# Altium schematic sheet EMatches.SchDoc: SPEX - INTERFACE - EMATCHES
size A4; Author: Derek Belsky; Revision: 0; SheetNumber: 3; SheetTotal: 6
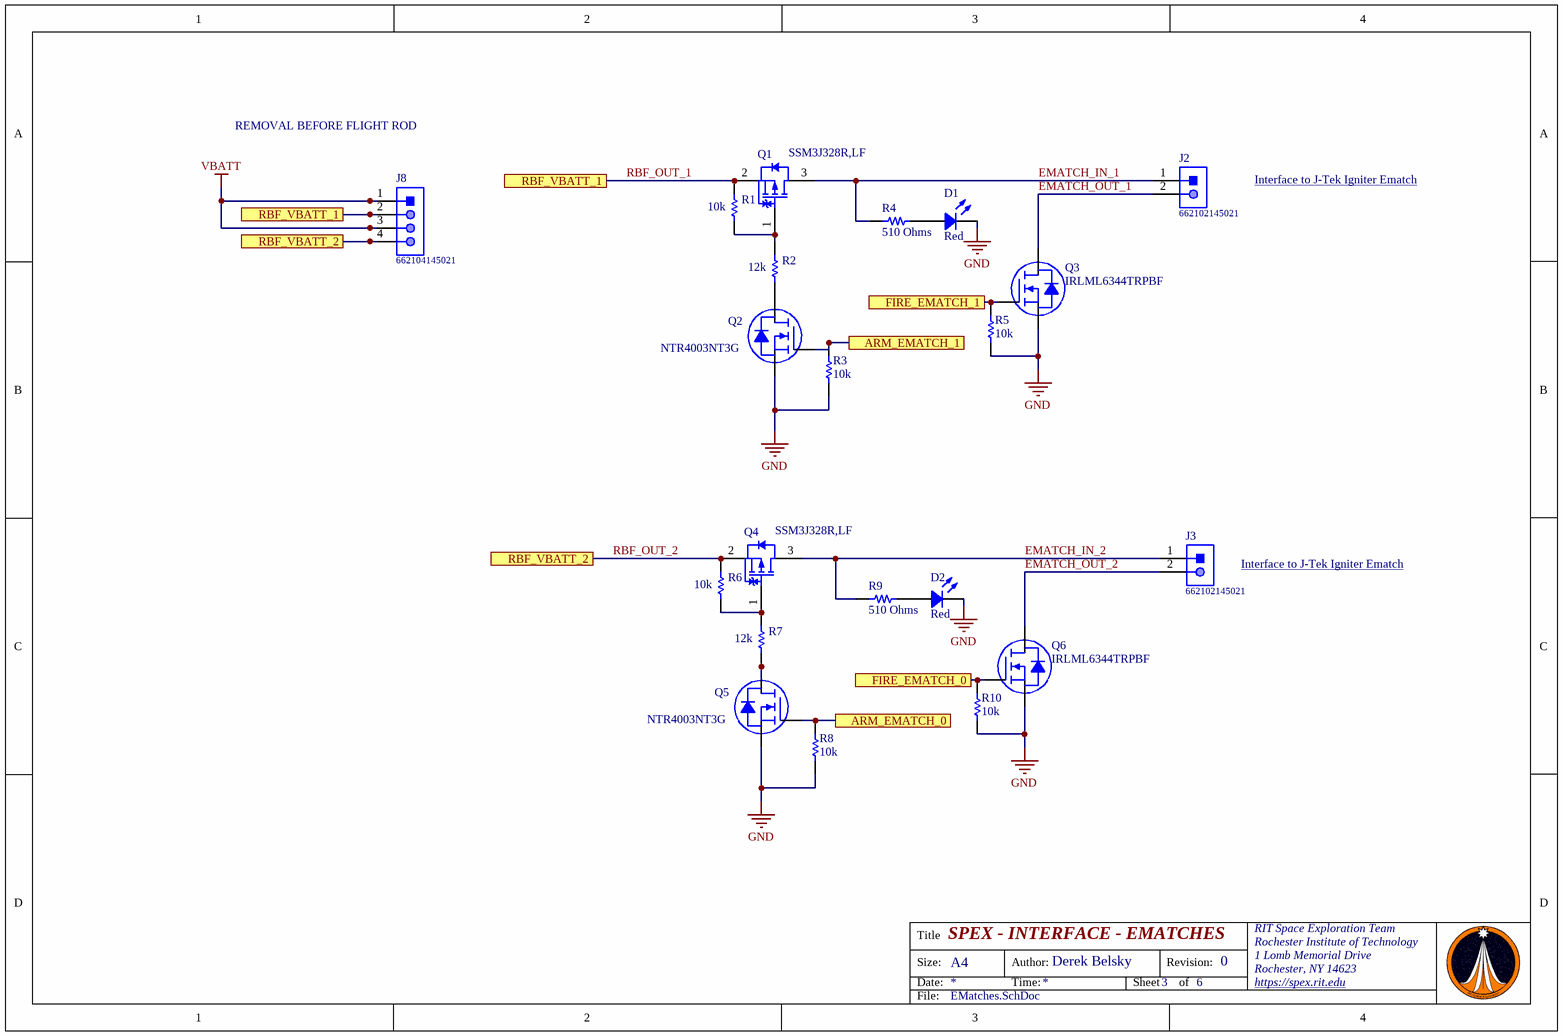
[diagram p0: EMatches.SchDoc]

## Parts
D1  Red  [LED 1206_3216 RED]
D2  Red  [LED 1206_3216 RED]
J2  662102145021  [662102145021]
J3  662102145021  [662102145021]
J8  662104145021  [662104145021]
Q1  SSM3J328R,LF  [TOSH-SOT-23F_V]
Q2  NTR4003NT3G  [ON SEMI SOT-23-3]
Q3  IRLML6344TRPBF  [INFINEON SOT-23-3]
Q4  SSM3J328R,LF  [TOSH-SOT-23F_V]
Q5  NTR4003NT3G  [ON SEMI SOT-23-3]
Q6  IRLML6344TRPBF  [INFINEON SOT-23-3]
R1  value 10k  [RESC1609X50X30NL8T20]  (hidden comment: CRCW060310K0FKEA)
R2  value 12k  [RESC1609X50X30LL10T20]  (hidden comment: CRCW060312K0FKEA)
R3  value 10k  [RESC1609X50X30NL8T20]  (hidden comment: CRCW060310K0FKEA)
R4  510 Ohms  [RES 0603_1608]
R5  value 10k  [RESC1609X50X30NL8T20]  (hidden comment: CRCW060310K0FKEA)
R6  value 10k  [RESC1609X50X30NL8T20]  (hidden comment: CRCW060310K0FKEA)
R7  value 12k  [RESC1609X50X30LL10T20]  (hidden comment: CRCW060312K0FKEA)
R8  value 10k  [RESC1609X50X30NL8T20]  (hidden comment: CRCW060310K0FKEA)
R9  510 Ohms  [RES 0603_1608]
R10  value 10k  [RESC1609X50X30NL8T20]  (hidden comment: CRCW060310K0FKEA)

## Ports
ARM_EMATCH_0, ARM_EMATCH_1, FIRE_EMATCH_0, FIRE_EMATCH_1, RBF_VBATT_1, RBF_VBATT_2

## Nets
GND: D1.2 D2.2 Q2.2(S) Q3.2(S) Q5.2(S) Q6.2(S) R3.2 R5.2 R8.2 R10.2
VBATT: J8.1 J8.3
ARM_EMATCH_0: Q5.1(G) R8.1 ; port ARM_EMATCH_0
ARM_EMATCH_1: Q2.1(G) R3.1 ; port ARM_EMATCH_1
EMATCH_IN_1: J2.1 Q1.3(D) R4.1
EMATCH_IN_2: J3.1 Q4.3(D) R9.1
EMATCH_OUT_1: J2.2 Q3.3(D)
EMATCH_OUT_2: J3.2 Q6.3(D)
FIRE_EMATCH_0: Q6.1(G) R10.1 ; port FIRE_EMATCH_0
FIRE_EMATCH_1: Q3.1(G) R5.1 ; port FIRE_EMATCH_1
RBF_OUT_1: J8.2 Q1.2(S) R1.2 ; port RBF_VBATT_1
RBF_OUT_2: J8.4 Q4.2(S) R6.2 ; port RBF_VBATT_2
NetD1_1: D1.1 R4.2
NetD2_1: D2.1 R9.2
NetQ1_1: Q1.1(G) R1.1 R2.2
NetQ2_3: Q2.3(D) R2.1
NetQ4_1: Q4.1(G) R6.1 R7.2
NetQ5_3: Q5.3(D) R7.1

## Notes on the sheet
- REMOVAL BEFORE FLIGHT ROD
- Interface to J-Tek Igniter Ematch <https://electricmatch.com/pyrotechnics/see/9/5/j-tek-igniter>
- Title
- Size:
- Date:
- A4
- Author:
- Time:
- Sheet
- Revision:
- of
- RIT Space Exploration Team
- Rochester Institute of Technology
- 1 Lomb Memorial Drive
- Rochester, NY 14623
- https://spex.rit.edu
- File:

## Library data of the parts
D1 D2 = HSMC-C350: LED RED CHIP SMD; Manufacturer: Broadcom Limited; Configuration: Standard; Current - Test: 20mA; Lens Color: 1.20mm; Lens Size: 1.10mm Dia; Lens Style: Round with Domed Top; Viewing Angle: 70°; Voltage - Forward (Vf) (Typ): 2V; Wavelength - Dominant: 630nm; Wavelength - Peak: 643nm; Part Number: HSMC-C350; Color: Red; ComponentLink1Description: Datasheet; ComponentLink1URL: https://docs.broadcom.com/docs/HSMC-C350-DS100; ComponentLink2Description: DigiKey Link; ComponentLink2URL: http://digikey.com/product-detail/en/broadcom-limited/HSMC-C350/516-4369-1-ND/10239796; Device Package: 1206 (3216 Metric); Height (Max): 1.20mm; LastUpdated: 1/21/2020 3:14:28 AM; Lifecycle Status: Active; Minimum Order: 1; Mounting Type: Surface Mount; Package / Case: 1206 (3216 Metric); Packaging: TapeAndReel; PartId: 195; Part Status: Active; Price: 0.21; Series: -; Size / Dimension: 3.20mm L x 1.60mm W; Supplier 1: DigiKey; Supplier Part Number 1: 516-4369-1-ND; Supplier Device Package: Chip LED; Value: Red
J2 J3 = CMP-1502-00482-1: SMT Male Header WR-MPC3, with SMT Solder Tabs, Right Angled, Single Row, pitch 3 mm, 2 pins; Manufacturer: Wurth Elektronik; Contact Resistance: 10mOhm; Working Voltage: 250VAC; Pitch: 3mm; Pin Number: 2; Mounting Technology: SMT; Orientation: RightAngled; Part Number: 662102145021; Datasheet URL: https://katalog.we-online.de/em/datasheet/6621xx145021.pdf; Manufacturer URL: http://www.we-online.de; Packaging: TapeandReel; Publisher: WurthElektronik; Gender: Male; Operating Temperature: -40to105degC; Package Reference: 662102145021
J8 = CMP-1502-00484-1: SMT Male Header WR-MPC3, with SMT Solder Tabs, Right Angled, Single Row, pitch 3 mm, 4 pins; Manufacturer: Wurth Elektronik; Pitch: 3mm; Pin Number: 4; Working Voltage: 250VAC; Contact Resistance: 10mOhm; Part Number: 662104145021; Packaging: TapeandReel; Manufacturer URL: http://www.we-online.de; Orientation: RightAngled; Datasheet URL: https://katalog.we-online.de/em/datasheet/6621xx145021.pdf; Operating Temperature: -40to105degC; Publisher: WurthElektronik; Mounting Technology: SMT; Gender: Male; Package Reference: 662104145021
Q1 Q4 = CMP-2100-03686-1: TOSHIBA Field-Effect Transistor Silicon P-Channel MOS Type (U-MOS VI), 20 V, -55 to 125 degC, 3-Pin SOTFL, RoHS, Tape and Reel; Gate to Source Voltage (Vgs): 8V; Drain to Source Breakdown Voltage: -20V; Turn-Off Delay Time: 107ns; Continuous Drain Current (ID): 6A; Rds On Max: 29.8mOhm; Number of Elements: 1; Turn-On Delay Time: 32ns; Drain to Source Resistance: 47.4mOhm; Drain to Source Voltage (Vdss): 20V; Power Dissipation: 2W; Element Configuration: Single; Max Power Dissipation: 1W; Input Capacitance: 840pF; Manufacturer URL: http://www.toshiba.com/; Number of Pins: 3; Number of Channels: 1; Max Operating Temperature: 150degC; Min Operating Temperature: -55degC; Manufacturer: Toshiba; Mount: SurfaceMount; Package Description: 3-Pin Small Outline Transistor, Flat Lead, Body 2.9 x 1.8 mm, Pitch 0.95 mm; Radiation Hardening: No; Package Quantity: 3000; Package Reference: SOT-23F; RoHSCompliant: true; Package URL: https://toshiba.semicon-storage.com/ap-en/design-support/package/detail.SOT-23F.html; Packaging: TapeandReel; Datasheet Version: 41699.0; Case/Package: SOT-23-3; Datasheet URL: https://toshiba.semicon-storage.com/info/docget.jsp?did=2429&prodName=SSM3J328R
Q2 Q5 = NTR4003NT3G: MOSFET N-CH 30V 500MA SOT-23; Manufacturer: ON Semiconductor; Current - Continuous Drain (Id) @ 25°C: 500mA (Ta); Drive Voltage (Max Rds On,  Min Rds On): 2.5V, 4V; FET Type: N-Channel; Gate Charge (Qg) (Max) @ Vgs: 1.15nC @ 5V; Input Capacitance (Ciss) (Max) @ Vds: 21pF @ 5V; Power Dissipation (Max): 690mW (Ta); Rds On (Max) @ Id, Vgs: 1.5Ohm @ 10mA, 4V; Vgs (Max): ±20V; Vgs(th) (Max) @ Id: 1.4V @ 250µA; Part Number: NTR4003NT3G; ComponentLink1Description: Datasheet; ComponentLink1URL: http://www.onsemi.com/pub/Collateral/NTR4003N-D.PDF; ComponentLink2Description: DigiKey Link; ComponentLink2URL: http://digikey.com/product-detail/en/on-semiconductor/NTR4003NT3G/NTR4003NT3GOSCT-ND/1967271; Device Package: TO-236-3, SC-59, SOT-23-3; Drain to Source Voltage (Vdss): 30V; LastUpdated: 1/21/2020 4:01:12 AM; Lifecycle Status: Active; Minimum Order: 1; Mounting Type: Surface Mount; Operating Temperature: -55°C ~ 150°C (TJ); Package / Case: TO-236-3, SC-59, SOT-23-3; Packaging: TapeAndReel; Part Status: Active; Price: 0.04; Series: -; Supplier 1: DigiKey; Supplier Part Number 1: NTR4003NT3GOSCT-ND; Supplier Device Package: SOT-23-3 (TO-236); Technology: MOSFET (Metal Oxide)
Q3 Q6 = IRLML6344TRPBF: MOSFET N-CH 30V 5A SOT23; Manufacturer: Infineon Technologies; Current - Continuous Drain (Id) @ 25°C: 5A (Ta); Drive Voltage (Max Rds On,  Min Rds On): 2.5V, 4.5V; FET Type: N-Channel; Gate Charge (Qg) (Max) @ Vgs: 6.8nC @ 4.5V; Input Capacitance (Ciss) (Max) @ Vds: 650pF @ 25V; Power Dissipation (Max): 1.3W (Ta); Rds On (Max) @ Id, Vgs: 29mOhm @ 5A, 4.5V; Vgs (Max): ±12V; Vgs(th) (Max) @ Id: 1.1V @ 10µA; Part Number: IRLML6344TRPBF; ComponentLink1Description: Datasheet; ComponentLink1URL: https://www.infineon.com/dgdl/irlml6344pbf.pdf?fileId=5546d462533600a4015356689c44262c; ComponentLink2Description: DigiKey Link; ComponentLink2URL: http://digikey.com/product-detail/en/infineon-technologies/IRLML6344TRPBF/IRLML6344TRPBFCT-ND/2538168; Device Package: TO-236-3, SC-59, SOT-23-3; Drain to Source Voltage (Vdss): 30V; LastUpdated: 1/21/2020 4:00:48 AM; Lifecycle Status: Active; Minimum Order: 1; Mounting Type: Surface Mount; Operating Temperature: -55°C ~ 150°C (TJ); Package / Case: TO-236-3, SC-59, SOT-23-3; Packaging: TapeAndReel; Part Status: Active; Price: 0.12; Series: HEXFET®; Supplier 1: DigiKey; Supplier Part Number 1: IRLML6344TRPBFCT-ND; Supplier Device Package: Micro3™/SOT-23; Technology: MOSFET (Metal Oxide)
R1 R3 R5 R6 R8 R10 = CMP-1666-00005-4: Chip Resistor, 10 KOhm, +/- 1%, 100 mW, -55 to 155 degC, 0603 (1608 Metric), RoHS, Tape and Reel; Manufacturer: Vishay Semiconductor; Voltage Rating: 75 V; Max Operating Temperature: 155 degC; PackageDescription: 2-Pin Surface Mount Device, Body 1.575 x 0.85 mm; ComponentLink1Description: Manufacturer URL; RoHSCompliant: true; PackageReference: 0603; REACH SVHC: Unknown; Length: 1.55 mm; DatasheetVersion: 06/2012; Packaging: Tape and Reel; Min Operating Temperature: -55 degC; Mounting Technology: Surface Mount; ComponentLink2URL: https://datasheet.ciiva.com/11809/0900766b80d98afc-11809037.pdf; Height: 0.45 mm; ComponentLink2Description: Datasheet; Package Quantity: 5000; ComponentLink1URL: http://www.vishay.com/
R2 R7 = CMP-2000-03877-1: Manufacturer: Vishay Dale; Part Number: CRCW060312K0FKEA
R4 R9 = CRCW0603510RFKEAHP: RES SMD 510 OHM 1% 1/4W 0603; Manufacturer: Vishay Dale; Power (Watts): 0.25W, 1/4W; Temperature Coefficient: ±100ppm/°C; Part Number: CRCW0603510RFKEAHP; Value: 510 Ohms; ComponentLink1Description: Datasheet; ComponentLink1URL: http://www.vishay.com/docs/20043/crcwhpe3.pdf; ComponentLink2Description: DigiKey Link; ComponentLink2URL: http://digikey.com/product-detail/en/vishay-dale/CRCW0603510RFKEAHP/541-510SCT-ND/5326852; Composition: Thick Film; Device Package: 0603 (1608 Metric); Features: Automotive AEC-Q200, Pulse Withstanding; Height - Seated (Max): 0.022" (0.55mm); LastUpdated: 1/21/2020 12:20:58 AM; Lifecycle Status: Active; Minimum Order: 1; Number of Terminations: 2; Operating Temperature: -55°C ~ 155°C; Package / Case: 0603 (1608 Metric); Packaging: TapeAndReel; PartId: 14772; Part Status: Active; Price: 0.02; Ratings: AEC-Q200; Resistance: 510 Ohms; Series: CRCW-HP; Size / Dimension: 0.063" L x 0.033" W (1.60mm x 0.85mm); Supplier 1: DigiKey; Supplier Part Number 1: 541-510SCT-ND; Supplier Device Package: 0603; Tolerance: ±1%